# EAGLE design Adafruit AR1100 (EAGLE 6.3)
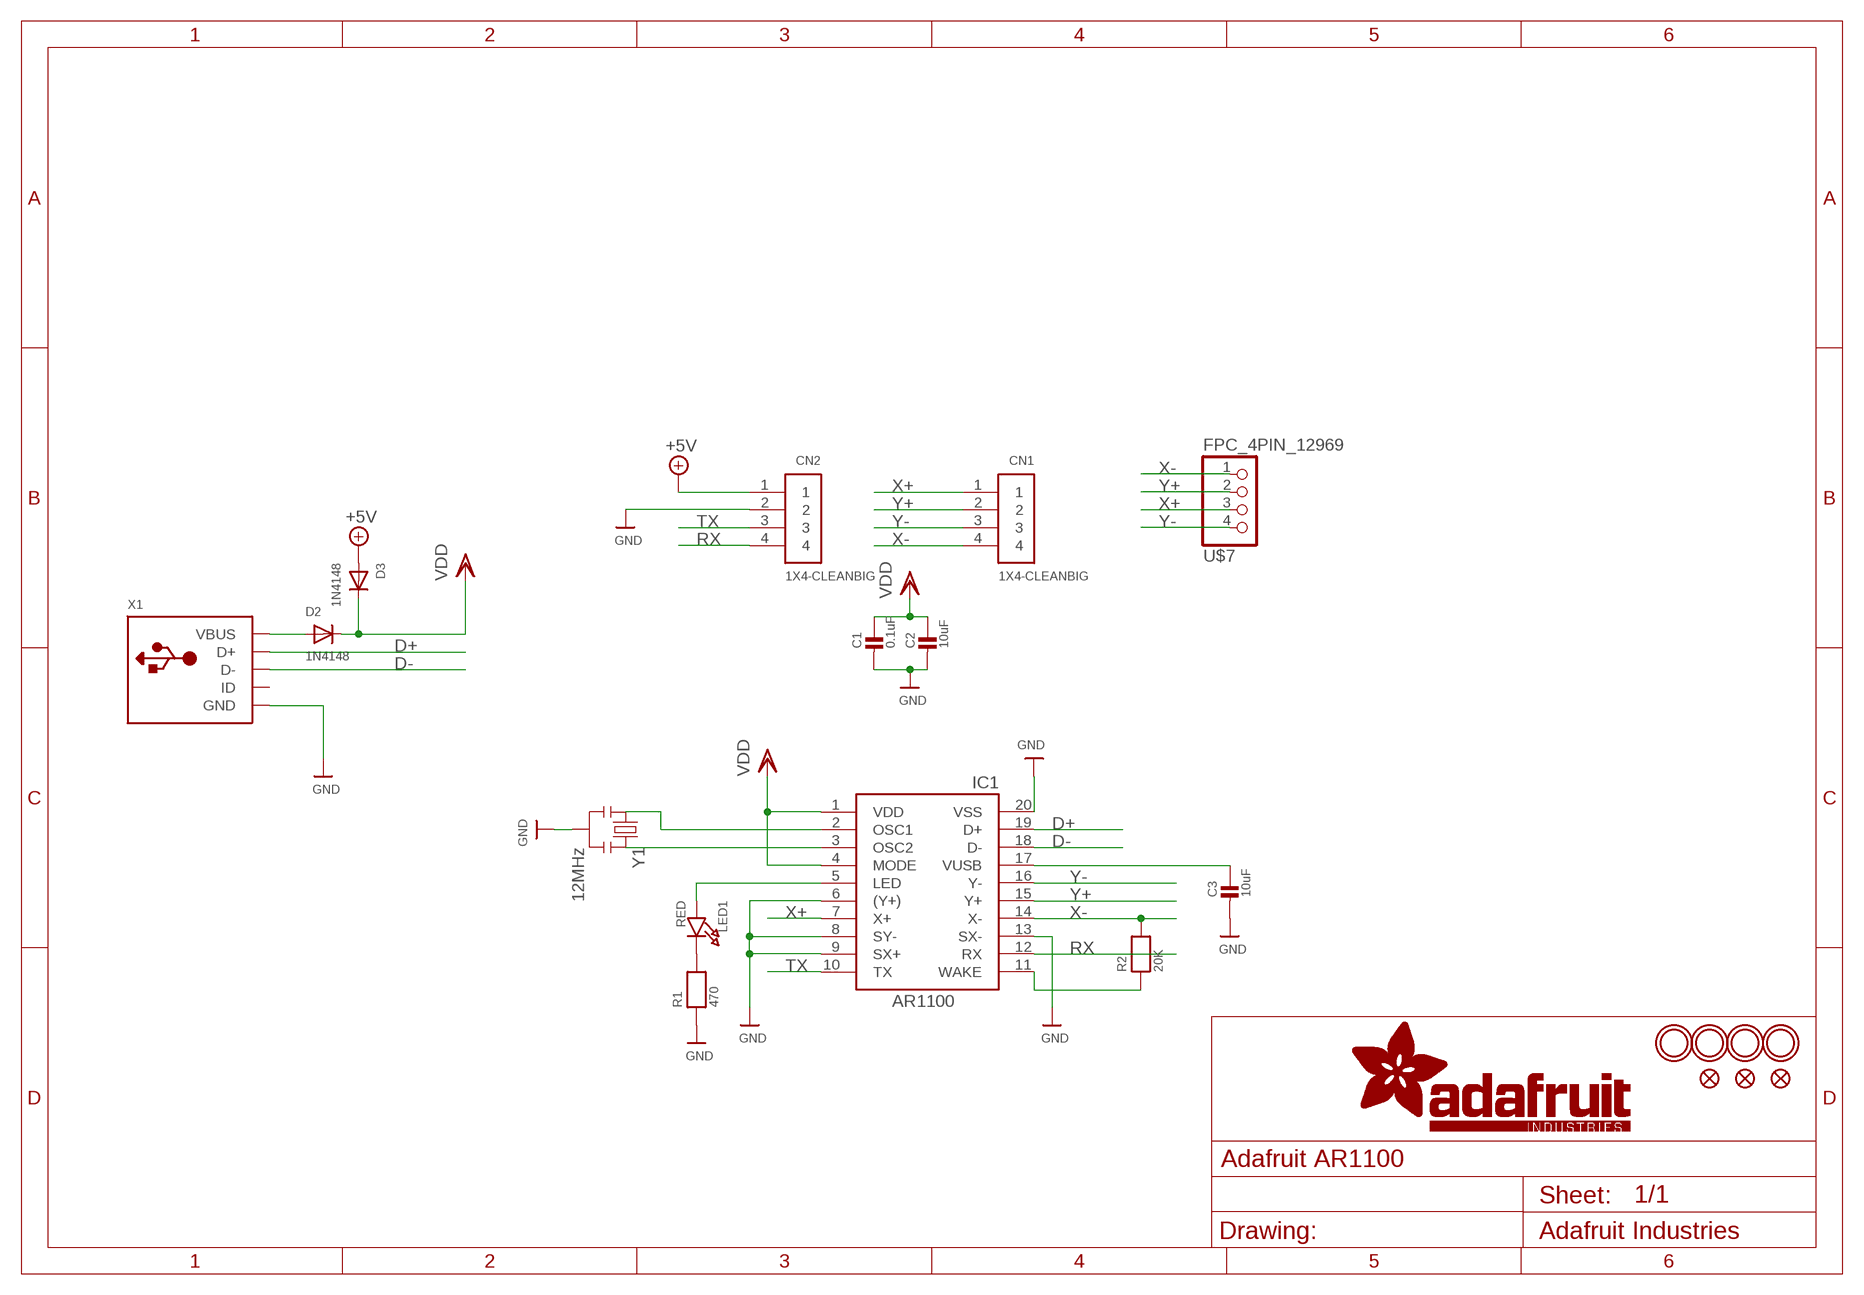
[diagram p0: schematic, sheet 1]

## Parts
C1  0.1uF  CAP_CERAMIC0805-NOOUTLINE  [0805-NO]
C2  10uF  CAP_CERAMIC0805-NOOUTLINE  [0805-NO]
C3  10uF  CAP_CERAMIC0805-NOOUTLINE  [0805-NO]
CN1  1X4-CLEANBIG  [1X04-CLEANBIG]
CN2  1X4-CLEANBIG  [1X04-CLEANBIG]
D2  1N4148  DIODESOD-323F  [SOD-323F]
D3  1N4148  DIODESOD-323F  [SOD-323F]
FID1  FIDUCIAL""  [FIDUCIAL_1MM]
FID2  FIDUCIAL""  [FIDUCIAL_1MM]
FID3  FIDUCIAL""  [FIDUCIAL_1MM]
IC1  AR1100_SSOP  [TSSOP20-5.3MMBODY]
LED1  RED  LED0805_NOOUTLINE  [CHIPLED_0805_NOOUTLINE]
R1  470  RESISTOR0805_NOOUTLINE  [0805-NO]
R2  20K  RESISTOR0805_NOOUTLINE  [0805-NO]
U$2  MOUNTINGHOLE2.5  [MOUNTINGHOLE_2.5_PLATED]
U$4  MOUNTINGHOLE2.5  [MOUNTINGHOLE_2.5_PLATED]
U$5  MOUNTINGHOLE2.5  [MOUNTINGHOLE_2.5_PLATED]
U$6  MOUNTINGHOLE2.5  [MOUNTINGHOLE_2.5_PLATED]
U$7  FPC_4PIN_12969  [FPC_CONN_1MM_DUAL_4P]
X1  USBMINIB  [USB-MINIB]
Y1  12MHz  RESONATORSMD  [RESONATOR-SMD]

## Nets
+5V: CN2.1 D3.A
D+: IC1.19(D+) X1.D+
D-: IC1.18(D-) X1.D-
GND: C1.2 C2.2 C3.2 CN2.2 IC1.6((Y+)) IC1.8(SY-) IC1.9(SX+) IC1.13(SX-) IC1.20(VSS) R1.1 X1.GND X1.GND1(GND) X1.GND2(GND) X1.GND3(GND) X1.GND4(GND) Y1.2
N$1: D2.A X1.VBUS
N$2: IC1.5(LED) LED1.A
N$3: LED1.C R1.2
N$4: C3.1 IC1.17(VUSB)
N$5: IC1.11(WAKE) R2.1
N$6: IC1.3(OSC2) Y1.3
N$7: IC1.2(OSC1) Y1.1
RX: CN2.4 IC1.12(RX)
TX: CN2.3 IC1.10(TX)
VDD: C1.1 C2.1 D2.C D3.C IC1.1(VDD) IC1.4(MODE)
X+: CN1.1 IC1.7(X+) U$7.3
X-: CN1.4 IC1.14(X-) R2.2 U$7.1
Y+: CN1.2 IC1.15(Y+) U$7.2
Y-: CN1.3 IC1.16(Y-) U$7.4
Unconnected: X1.ID

## Library data of the parts
C1-C3 = microbuilder:CAP_CERAMIC: Ceramic Capacitors For new designs, use the packages preceded by an '_' character since they are more reliable: The following footprints should be used on most boards: _0402 - Standard footprint for regular board layouts _0603 - Standard footprint for regular board layouts _0805 - Standard footprint for regular board layouts For extremely tight-pitch boards where space is at a premium, the following 'micro-pitch' footprints can be used (smaller pads, no silkscreen outline, etc.): _0402MP - Micro-pitch footprint for very dense/compact boards _0603MP - Micro-pitch footprint for very dense/compact boards _0805MP - Micro-pitch footprint for very dense/compact boards Commonly Stocked Parts 0402 - 0402 Surface Mount Capacitors 16pF 50V 5% [Digikey: 445-4899-2-ND] 18pF 50V 5% [Digikey: 490-1281-2-ND] 22pF 50V 5% [Digikey: 490-1283-2-ND] 68pF 50V 5% [Digikey: 490-1289-2-ND] 0.1uF 10V 10% [Digikey: 490-1318-2-ND] 1.0uF 6.3V 10% [Digikey: 490-1320-2-ND] 0603 - 0603 Surface Mount Capacitors 16 pF 50V 5% [Digikey: 445-5051-2-ND] 22 pF 50V [Digikey: PCC220ACVTR-ND] 33 pF 50V 5% [Digikey: 490-1415-1-ND] 56pF 50V 5% [Digikey: 490-1421-1-ND] 220pF 50V 5% [Digikey: 445-1285-1-ND] 680 pF 50V 2200 pF 50V 5% C0G [Digikey: 445-1297-1-ND] 5600 pF 100V 5% X7R [Digikey: 478-3711-1-ND] 0.1 µF 25V 10% [Digikey: PCC2277TR-ND] 0.22 µF 16V 10% X7R [Digikey: 445-1318-1-ND] 1.0 µF 25V 10% [Digikey: 445-5146-2-ND] 0603 - RF Specific 3pF 250V +/-0.1pF RF [Digikey: 712-1347-1-ND] 18 pF 250V 5% [Digikey: 478-3505-1-ND or 712-1322-1-ND] 56 pF 250V 5% C0G RF [Digikey: 490-4867-1-ND] 68 pF 250V RF [Digikey: 490-4868-1-ND] 0805 - 0805 Surface Mount Capacitors 220 pF 250V 2% RF Ceramic Capacitor [Digikey: 712-1398-1-ND] 1000 pF 50V 2% NP0 Ceramic Capacitor [Digikey: 478-3760-1-ND] 0.1 µF 25V 10% Ceramic Capacitor [Digikey: PCC1828TR-ND] 1.0 µF 16V 10% Ceramic Capacitor[Digikey: 490-1691-2-ND] 10.0 µF 10V 10% Ceramic Capacitor[Digikey: 709-1228-1-ND] 10.0 uF 16V 10% Ceramic Capacitor [Digikey: 478-5165-2-ND] 47 uF 6.3V 20% Ceramic Capacitor [Digikey: 587-1779-1-ND or 399-5506-1-ND] 1206 - 1206 Surface Mount Capacitors 47uF 10V 20% Ceramic Capacitor [Digikey: 490-5528-1-ND or 399-5508-1-ND or 445-6010-1-ND] 100uF 6.3V -20%, +80% Y5V Ceramic Capacitor (Digikey: 490-4512-1-ND, Mouser: 81-GRM31CF50J107ZE1L)
CN1 CN2 = adafruit:1X4: 4-pin connector
D2 D3 = adafruit:DIODE: Diode SMADIODE - SMA Surface Mount Package 20V 1A Schottky Diode Digikey: 641-1014-6-ND DO-1N4148 - Through Hole Small Current Diode SOD-123 20V 1 A (.5mV Vf) Schottky Diode - Digikey: MBRX120TPMSCT-ND SOD-323 10V 570mA (.38mV Vf, 3ns) Schottky Diode - Digikey: ZLLS410CT-ND SOD-523 30V 30mA Schottky Diode (RB751S-40TE61) - Digikey: RB751S-40TE61CT-ND SOT23-R/W - SOT23 Package (R = Solder Paste/Reflow Ovens, W = Hand-Soldering) BAT54Film 40V 300mA - Digikey: 497-7162-1-ND
FID1-FID3 = microbuilder:FIDUCIAL: Fiducial Alignment Points Various fiducial points for machine vision alignment.; BOM: EXCLUDE
IC1 = microbuilder:AR1100
LED1 = microbuilder:LED: LED 0603 - 0603 Surface Mount Package 2mA: Green LED - Low Power (3.9mcd, 2ma, 1.7Vf) - Digikey: 475-2709-2-ND Orange LED - Low Power (9.8mcd, 2ma, 1.8Vf) - Digikey: 475-1194-2-ND Red LED - Low Power (5mcd, 2ma, 1.8Vf) - Digikey: 475-1195-2-ND Yellow LED - Low Power (7mcd, 2ma, 1.8Vf) - Digikey: 475-1196-2-ND 5mA: Blue LED - Low Power (17mcd, 5ma, 2.9Vf) - Digikey: LNJ937W8CRACT-ND 0805 - 0805 Surface Mount Package 2mA: Red LED (8.8mcd, 2mA, 1.8Vf, Clear) - Low Power [Digikey: 475-2510-1-ND] Green LED (5mcd, 2mA, 1.8Vf, Clear) - Low Power [Digikey: 475-2730-1-ND] Yellow LED (11.3mcd, 2mA, 1.8Vf, Clear) - Low Power [Digikey: 475-2555-1-ND] 20mA: Red LED (104mcd, 20mA, Diffused) - LS R976 [Digikey: 475-1278-6-ND] Red LED (12mcd, 20mA, 2.0Vf, Clear) - APT2012EC [Digikey: 754-1128-1-ND] Green LED (15mcd, 20mA, 2.2Vf, Clear) - APT2012GC [Digikey: 754-1131-1-ND] Orange LED (160mcd, 20mA, 2.1Vf, Clear) - APT2012SECK [Digikey: 754-1130-1-ND] 1206 - 1206 Surface Mount Package Green LED (26mcd, 20mA, Diffused) - LG N971 [Digikey: 475-1407-6-ND] Red LED (15mcd, 20mA, Diffused) - LH N974 [Digikey: 475-1416-6-ND] Cree - Cree High-Power Surface Mount LEDs XPEBWT-L1-0000-00D50 - White 111lm 350mA 2.9Vf 6200K 110° XTEAWT-00-0000-00000LEE3 - White 114lm 350mA 2.85Vf 5000K 115° Everlight - Everlight 45-21 Series Surface Mount LEDs 45-21/QK2C-B2832AC2CB2/2T - Warm White 2000mcd 20mA 3.25Vf 3050K 120° 45-21/LK2C-B38452C4CB2/2T - Nuetral White 2000mcd 20mA 3.25Vf 4150K 120° 45-21/LK2C-B50634C6CB2/2T - Cold White 2200mcd 20mA 3.25Vf 5650K 120° PLCC2 Reverse Mount LS T77K-J1L2-1-0-2-R18-Z - Red 11.25mcd 2mA 1.8Vf 630nm 120° LO T77K-L1M2-24-Z - Orange 19.6mcd 2mA 1.8Vf 606nm 120° LY T77K-K2M1-26-Z - Yellow 15.7mcd 2mA 1.8Vf 587nm 120°
R1 R2 = microbuilder:RESISTOR: Resistors For new designs, use the packages preceded by an '_' character since they are more reliable: The following footprints should be used on most boards: _0402 - Standard footprint for regular board layouts _0603 - Standard footprint for regular board layouts _0805 - Standard footprint for regular board layouts For extremely tight-pitch boards where space is at a premium, the following 'micro-pitch' footprints can be used (smaller pads, no silkscreen outline, etc.): _0402MP - Micro-pitch footprint for very dense/compact boards _0603MP - Micro-pitch footprint for very dense/compact boards _0805MP - Micro-pitch footprint for very dense/compact boards
U$2 U$4-U$6 = microbuilder:MOUNTINGHOLE: Mounting Hole For #2 screws (0.086"/2.18mm width, 0.094"/2.4mm hole) use 2.5mm; BOM: EXCLUDE
U$7 = microbuilder:FPC_4PIN
X1 = microbuilder:USB: USB Connectors USBMINIB - Surface Mount Female Mini-B USB Connector 4UConnector: 06564
Y1 = SparkFun:RESONATOR: Resonator Small SMD resonator. This is the itty bitty 10/20MHz resonators with built in caps. CSTCE10M0G55 and CSTCE20M0V53. Footprint has been reviewed closely but hasn't been tested yet.

## Board
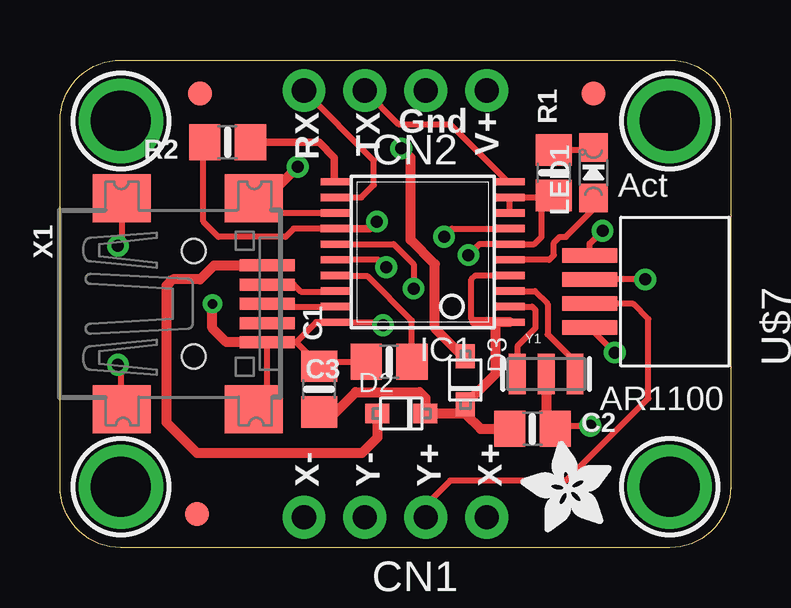
[diagram p1: board, top side]
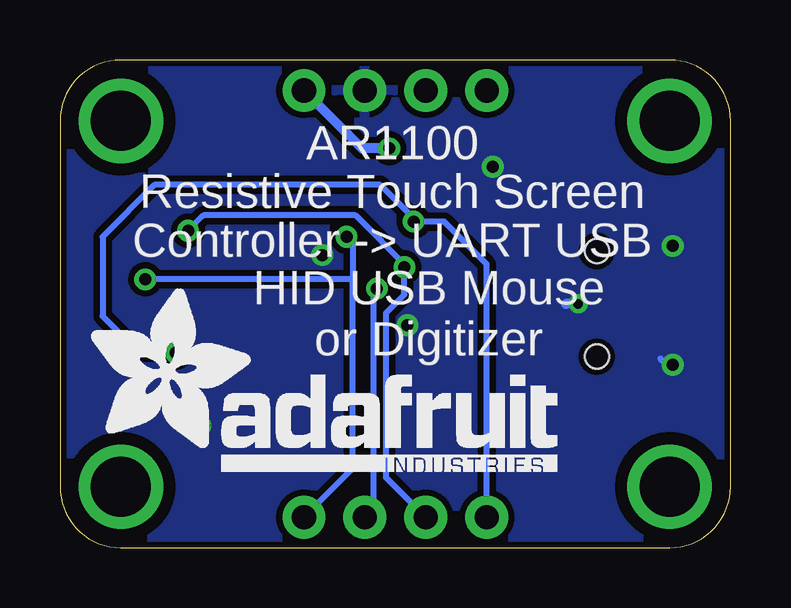
[diagram p2: board, bottom side, seen from below]

Size 27.94 x 20.32 mm. Coordinates in mm from the lower left corner, seen from the top.
Outline: 2.54,20.32 25.4,20.32 arc-90 27.94,17.78 27.94,2.54 arc-90 25.4,0 2.54,0 arc-90 0,2.54 0,17.78 arc-90 2.54,20.32
Copper layers (1*16): Top 0.035mm / dielectric 1.5mm / Bottom 0.035mm
Design rules "adafruit *": minimum track width 8mil, minimum drill 15.5mil, track to track 8mil, track to pad 8mil, pad to pad 8mil, via to via 8mil, smd to smd 8mil, copper to edge 10mil, drill to drill 8mil, minimum pad ring 10mil, minimum via ring 8mil, stop-mask expansion 4mil, vias tented up to drill 20mil, thermal gap 10mil

### Footprints (pad centres in the part's own frame; a part is rotated, then mirrored left to right if it is on the bottom)
0805-NO = smd 1.3 x 1.5: 1 -0.95,0; 2 0.95,0
1X04-CLEANBIG = drill 1.016 pad 1.778: 1 -3.81,0; 2 -1.27,0; 3 1.27,0; 4 3.81,0
SOD-323F = smd 1 x 0.8: A -1,0; C 1,0
FIDUCIAL_1MM = smd 1 x 1: 1 0,0
TSSOP20-5.3MMBODY = smd 0.305 x 1.27: 1 -2.925,-3.618; 2 -2.275,-3.618; 3 -1.625,-3.618; 4 -0.975,-3.618; 5 -0.325,-3.618; 6 0.325,-3.618; 7 0.975,-3.618; 8 1.625,-3.618; 9 2.275,-3.618; 10 2.925,-3.618; 11 2.925,3.618; 12 2.275,3.618; 13 1.625,3.618; 14 0.975,3.618; 15 0.325,3.618; 16 -0.325,3.618; 17 -0.975,3.618; 18 -1.625,3.618; 19 -2.275,3.618; 20 -2.925,3.618
CHIPLED_0805_NOOUTLINE = smd 1.2 x 1.2: A 0,-1.05; C 0,1.05
MOUNTINGHOLE_2.5_PLATED = drill 2.5 pad 3.2: P$1 0,0
FPC_CONN_1MM_DUAL_4P = smd 0.6 x 2.3: 1 -1.5,1.3; 2 -0.5,1.3; 3 0.5,1.3; 4 1.5,1.3
USB-MINIB = smd 0.5 x 2.308: D+ 0,4.064; D- -0.8,4.064; GND 1.6,4.064; ID 0.8,4.064; VBUS -1.6,4.064 | smd 2 x 2.4: GND1 -4.4,-2; GND2 -4.4,3.5; GND3 4.4,3.5; GND4 4.4,-2 | hole 1: -2.2,1; 2.2,1
RESONATOR-SMD = smd 0.7 x 1.7: 1 -1.2,0; 2 0,0; 3 1.2,0

### Placement (x,y rotation side)
C1  10.79,6.6 90 top
C2  19.69,4.95 0 top
C3  13.72,7.75 180 top
CN1  13.97,1.27 180 top
CN2  13.97,19.05 180 top
D2  14.22,5.59 0 top
D3  16.89,6.99 270 top
FID1  22.23,18.92 0 top
FID2  5.71,1.4 0 top
FID3  5.84,18.92 0 top
IC1  15.11,12.32 90 top
LED1  22.23,15.62 0 top
R1  20.57,15.62 90 top
R2  6.98,16.89 180 top
U$2  2.54,2.54 0 top
U$4  2.54,17.78 0 top
U$5  25.4,17.78 0 top
U$6  25.4,2.54 0 top
U$7  23.37,10.67 90 top
U$14  [ADAFRUIT_3.5MM]  22.99,0.64 90 top
U$17  [ADAFRUIT_TEXT_20MM]  26.8,3.17 0 bottom
X1  4.57,10.16 270 top
Y1  20.26,7.24 0 top

### Tracks (layer width: path | path; a pad name or v marks a point on that pad's centre or on a via)
+5V  (via drill 0.5)
  Top 0.406: D3.A 16.89,7.87 15.62,9.14 15.62,11.81 14.61,12.83 14.61,16.26 v14.22,16.64
  Bottom 0.406: v14.22,16.64 15.37,16.64 CN2.1
D+
  Top 0.254: X1.D+ 8.75,10.04 IC1.19
D-
  Top 0.254: X1.D- 9.74,10.96 10.03,10.67 11.47,10.67 IC1.18
GND  (via drill 0.39, 0.5)
  Top 0.254: 9.84,8.56 X1.GND 8.64,6.32 X1.GND3 7.45,5.76 7.37,5.84 | 8.69,13.94 X1.GND2 | 9.84,8.56 10.79,7.6 C1.2 10.99,7.75 C3.2 | v13.46,9.27 13.34,9.39 IC1.20 10.67,9.39 9.84,8.56 | IC1.8 IC1.9 20.07,14.59 | v2.41,7.62 2.53,7.51 2.53,5.81 X1.GND4 | X1.GND1 2.57,12.73 v2.41,12.57 | IC1.13 8.69,13.94 | 8.69,13.94 8.64,13.94 | 20.07,14.59 20.5,14.59 R1.1 | C2.2 20.76,5.08 v22.1,5.08 | 20.07,14.59 20.07,12.95 19.76,12.64 IC1.6 17.47,12.64 v17.02,12.19
  Top 0.406: Y1.2 20.26,4.95 C2.2 | X1.GND2 8.59,14.56 v9.91,15.88 | X1.GND 6.93,8.56 6.35,9.14 v6.35,10.16
  Bottom 0.254: v2.41,7.62 2.67,7.62 2.92,7.87 | v2.41,12.57 2.41,12.32 | v22.1,5.08 22.1,5.33
  Bottom 0.406: v6.35,10.16 6.86,10.16
  pour Bottom (isolate 0.254): 0,0 0,20.32 27.94,20.32 27.94,0
N$1
  Top 0.406: D2.A 13.22,4.59 12.57,3.94 5.71,3.94 4.45,5.21 4.45,10.92 4.7,11.18 5.84,11.18 6.43,11.76 X1.VBUS
N$2
  Top 0.254: LED1.A 22.23,14.1 21.08,12.95 20.83,12.95 20.57,12.7 20.57,12.19 20.38,11.99 IC1.5
N$3
  Top 0.254: R1.2 22.12,16.57 LED1.C
N$4
  Top 0.254: C3.1 14.67,9.46 12.83,11.3 11.54,11.3 IC1.17
N$5
  Top 0.305: R2.1 10.79,16.89 11.43,16.26 11.43,15.31 IC1.11
N$6
  Top 0.254: IC1.3 19.79,10.69 20.32,10.16 20.32,8.89 21.34,7.87 21.34,7.36 Y1.3
N$7
  Top 0.254: IC1.2 19.67,10.04 19.81,9.91 19.81,9.14 19.06,8.39 Y1.1
RX
  Top 0.254: IC1.12 12.56,14.59 13.08,15.11 13.08,16.13 CN2.4
TX
  Top 0.254: CN2.3 14.1,17.65 16.26,17.65 18.66,15.24 IC1.10
VDD
  Top 0.254: 17.28,9.39 17.14,9.53 17.14,11.18 17.31,11.34 IC1.4
  Top 0.406: IC1.1 18.13,9.39 | 18.13,9.39 17.28,9.39 | C1.1 10.86,5.59 11.43,5.59 12.32,6.48 14.99,6.48 15.22,6.24 D2.C 16.89,5.59 | 16.89,5.59 D3.C 18.13,7.22 18.13,9.39 | 16.89,5.59 17.53,4.95 C2.1
X+  (via drill 0.5)
  Top 0.254: IC1.7 16.34,13.29 v16,12.95 | v24.38,11.18 22.08,11.18 U$7.3
  Bottom 0.254: CN1.1 15.75,3.3 15.75,11.18 | v16,12.95 15.75,12.7 15.75,11.18 | 15.75,11.18 v24.38,11.18
X-  (via drill 0.5)
  Top 0.254: IC1.14 9.74,13.29 9.4,12.95 6.6,12.95 5.97,13.59 5.97,16.96 5.9,16.89 R2.2 | v23.11,8.13 U$7.1
  Top 0.305: IC1.14 12.91,13.29 v13.21,13.59
  Bottom 0.254: CN1.4 10.16,11.81 11.94,13.59 v13.21,13.59 13.21,13.72 14.61,15.11 24,15.11 26.16,12.95 26.16,9.65 24.64,8.13 v23.11,8.13
Y+  (via drill 0.5)
  Top 0.254: CN1.2 15.24,1.78 16.26,2.79 21.08,2.79 24.51,6.22 24.51,9.53 23.88,10.16 22.08,10.16 U$7.2 | IC1.15 13.9,12.64 14.73,11.81 v14.73,10.79
  Bottom 0.254: CN1.2 14.86,1.65 14.86,10.41 14.73,10.54 v14.73,10.79
Y-  (via drill 0.5)
  Top 0.254: v13.59,11.68 13.28,11.99 IC1.16 | U$7.4 22.07,12.67 v22.61,13.21
  Bottom 0.254: CN1.3 14.35,2.92 14.35,9.78 13.59,10.54 v13.59,11.68 13.46,11.68 15.62,13.84 21.97,13.84 v22.61,13.21

### Text on the board
tPlace: RX | TX | V+ | Gnd | Act | AR1100 | X- | Y- | Y+ | X+
bPlace: AR1100 | Resistive Touch Screen | Controller -> UART USB | HID USB Mouse / or Digitizer